# EAGLE design MIC23050-breakout (EAGLE 9.3.2)
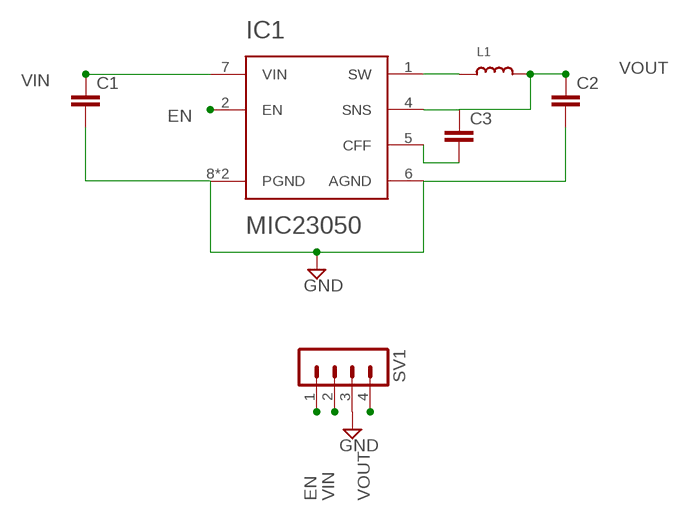
[diagram p0: schematic, sheet 1]

## Parts
C1  C-EUC0603  [C0603]
C2  C-EUC0603  [C0603]
C3  C-EUC0603  [C0603]
IC1  MIC23050  [MLF_2X2]
L1  INDUCTOR0805  [0805]
SV1  MA04-1  [MA04-1]

## Nets
EN: IC1.2(EN) SV1.1
GND: C1.2 C2.2 IC1.6(AGND) IC1.8(PGND) IC1.9(PGND) SV1.3
N$2: C3.2 IC1.5(CFF)
N$6: IC1.1(SW) L1.1
VIN: C1.1 IC1.7(VIN) SV1.2
VOUT: C2.1 C3.1 IC1.4(SNS) L1.2 SV1.4

## Library data of the parts
C1-C3 = rcl:C-EU: CAPACITOR, European symbol; SPICEPREFIX: C
IC1 = power:MIC23050
L1 = microbuilder:INDUCTOR: Inductors 0603: 10nH Ceramic Inductor - microwire antenna/RF (Digikey: 712-1434-2-ND) 0805: 560nH Ceramic Inductor - RF (Digikey: 553-1047-1-ND) 270nH Ceramic Inductor - Q = 40@250MHz, +-5%, 1 Ohm DC Resistance (Digikey: 535-10506-2-ND) 1007 (2518 Metric) SMT: 10µH 10% 250mOhm 820mA 1007 Inductor (Digikey: 587-2189-1-ND) 22µH 10% 500mOhm 580mA 1007 Inductor (Digikey: 587-2190-1-ND) 47µH 10% 950mOhm 420mA 1007 Inductor (Digikey: 587-2191-1-ND) 47µH 5% 100mOhm 1A 1008 Inductor (Digikey: 732-1816-1-ND) 5.0x5.0mm (Taiyo Yuden NR5040 Series) 6.8µH 20% 2.3A 64mOhm Inductor (Digikey: 587-2374-2-ND) 5.0x5.0mm (TDK VLC5045 Series) 4.7µH 20% 3.3A 34mOhm Inductor (Digikey: 445-6526-1-ND) 6.8µH 20% 2.7A 46mOhm Inductor (Digikey: 445-6527-1-ND) 6.0x6.0mm (TDK VLC6045 Series) 4.7µH 20% 3.8A 27mOhm Inductor (Digikey: 445-6538-2-ND) 6.8µH 20% 3A 41mOhm Inductor (Digikey: 445-6540-1-ND) 6.2µH 30% 2.2A 45mOhm Inductor (Digikey: SRR5028-6R2YCT-ND) - Not TDK VLC6045 but footprint should match 6.0x6.0mm (TDK SLF6045 Series) 6.8uH 30% 2A 33mOhm Inductor (Digikey: 445-4572-1-ND, Mouser: 810-SLF645T6R8N2R0PF)
SV1 = con-lstb:MA04-1: PIN HEADER; OC_FARNELL: unknown; OC_NEWARK: unknown

## Board
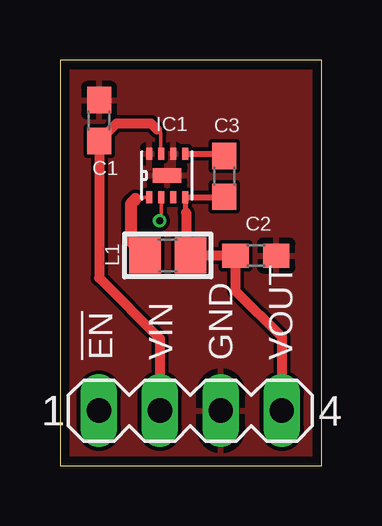
[diagram p1: board, top side]
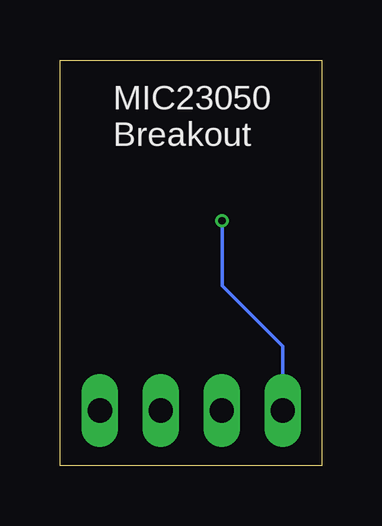
[diagram p2: board, bottom side, seen from below]

Size 10.9 x 16.9 mm. Coordinates in mm from the lower left corner, seen from the top.
Outline: 0,0 10.9,0 10.9,16.9 0,16.9 0,0
Copper layers (1*16): Top 0.035559375mm / dielectric 1.6mm / Bottom 0.035559375mm
Design rules "oshpark-2layer": minimum track width 6mil, minimum drill 10mil, track to track 6mil, track to pad 6mil, pad to pad 6mil, via to via 6mil, smd to smd 6mil, copper to edge 15mil, drill to drill 6mil, minimum pad ring 5mil, minimum via ring 5mil, stop-mask expansion 2.5mil, vias tented up to drill 0mil, thermal gap 10mil

### Footprints (pad centres in the part's own frame; a part is rotated, then mirrored left to right if it is on the bottom)
C0603 = smd 1.1 x 1: 1 -0.85,0; 2 0.85,0
MLF_2X2 = smd 0.5 x 0.25: 1 -0.9,0.75; 2 -0.9,0.25; 3 -0.9,-0.25; 4 -0.9,-0.75; 5 0.9,-0.75; 6 0.9,-0.25; 7 0.9,0.25; 8 0.9,0.75 | smd 0.6 x 1.2: 9 0,0
0805 = smd 1.3 x 1.5: 1 -0.95,0; 2 0.95,0
MA04-1 = drill 1.016 long: 1 -3.81,0; 2 -1.27,0; 3 1.27,0; 4 3.81,0

### Placement (x,y rotation side)
C1  1.63,14.38 90 top
C2  8.16,8.75 0 top
C3  6.85,12.05 90 top
IC1  4.46,12.09 90 top
L1  4.49,8.76 0 top
SV1  5.43,2.29 0 top

### Tracks (layer width: path | path; a pad name or v marks a point on that pad's centre or on a via)
EN  (via drill 0.3)
  Top 0.152: IC1.2 4.21,10.26 v4.15,10.2
  Bottom 0.152: v4.15,10.2 4.15,7.5 1.62,4.97 SV1.1
GND
  pour Top: 0,0 10.9,0 10.9,16.9 0,16.9
N$2
  Top 0.254: IC1.5 6.76,12.99 C3.2
N$6
  Top 0.152: IC1.1 3.24,11.19 3.2,11.15
  Top 0.305: 3.2,11.15 3.15,11.1
  Top 0.508: 3.15,11.1 2.95,10.9 2.95,9.35 L1.1
VIN
  Top 0.152: IC1.7 arc-90 IC1.7 4.2,13.85 4.15,13.9
  Top 0.203: 4.15,13.9 4.1,13.95
  Top 0.254: 4.1,13.95 4.05,14
  Top 0.406: 4.05,14 3.8,14.25 2.35,14.25 C1.1 1.63,7.82 4.16,5.29 SV1.2
VOUT
  Top 0.2: IC1.4 5.21,10.64 5.25,10.6
  Top 0.254: 5.25,10.6 5.25,10.55 | IC1.4 C3.1
  Top 0.406: 5.25,10.55 5.25,8.95 L1.2 C2.1 7.31,7.29 9.24,5.36 SV1.4

### Text on the board
bPlace: MIC23050 / Breakout
tNames: !EN | VIN | GND | VOUT